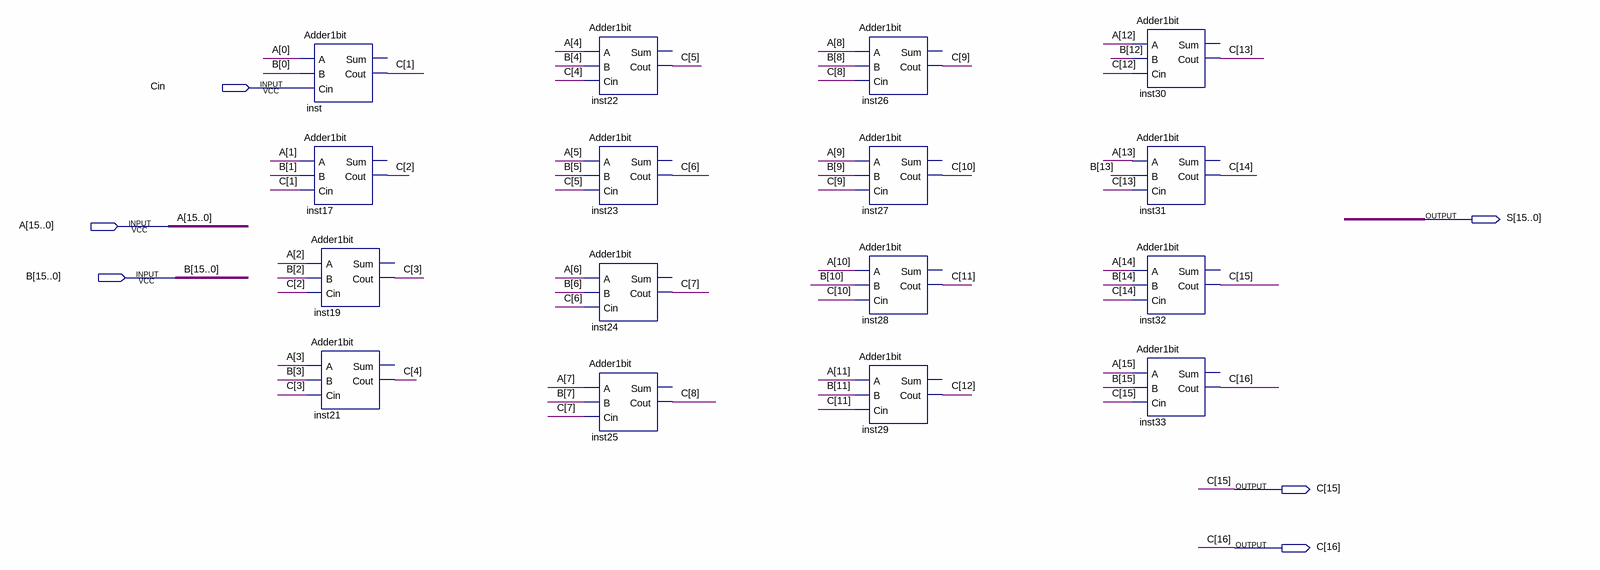
[diagram p0: schematic sheet]
// Quartus schematic FullAdder16bit.bdf as structural Verilog: 16 symbols, 6 pins
module FullAdder16bit (
  input  Cin,
  input  [15:0] A,
  input  [15:0] B,
  output [15:0] S,
  output [16:1] C
);

  Adder1bit inst (.A(A[0]), .B(B[0]), .Cin(Cin), .Cout(C[1]));  // open: Sum
  Adder1bit inst17 (.A(A[1]), .B(B[1]), .Cin(C[1]), .Cout(C[2]));  // open: Sum
  Adder1bit inst19 (.A(A[2]), .B(B[2]), .Cin(C[2]), .Cout(C[3]));  // open: Sum
  Adder1bit inst21 (.A(A[3]), .B(B[3]), .Cin(C[3]), .Cout(C[4]));  // open: Sum
  Adder1bit inst22 (.A(A[4]), .B(B[4]), .Cin(C[4]), .Cout(C[5]));  // open: Sum
  Adder1bit inst23 (.A(A[5]), .B(B[5]), .Cin(C[5]), .Cout(C[6]));  // open: Sum
  Adder1bit inst24 (.A(A[6]), .B(B[6]), .Cin(C[6]), .Cout(C[7]));  // open: Sum
  Adder1bit inst25 (.A(A[7]), .B(B[7]), .Cin(C[7]), .Cout(C[8]));  // open: Sum
  Adder1bit inst26 (.A(A[8]), .B(B[8]), .Cin(C[8]), .Cout(C[9]));  // open: Sum
  Adder1bit inst27 (.A(A[9]), .B(B[9]), .Cin(C[9]), .Cout(C[10]));  // open: Sum
  Adder1bit inst28 (.A(A[10]), .B(B[10]), .Cin(C[10]), .Cout(C[11]));  // open: Sum
  Adder1bit inst29 (.A(A[11]), .B(B[11]), .Cin(C[11]), .Cout(C[12]));  // open: Sum
  Adder1bit inst30 (.A(A[12]), .B(B[12]), .Cin(C[12]), .Cout(C[13]));  // open: Sum
  Adder1bit inst31 (.A(A[13]), .B(B[13]), .Cin(C[13]), .Cout(C[14]));  // open: Sum
  Adder1bit inst32 (.A(A[14]), .B(B[14]), .Cin(C[14]), .Cout(C[15]));  // open: Sum
  Adder1bit inst33 (.A(A[15]), .B(B[15]), .Cin(C[15]), .Cout(C[16]));  // open: Sum
endmodule
